# EAGLE design node (EAGLE 9.6.2)
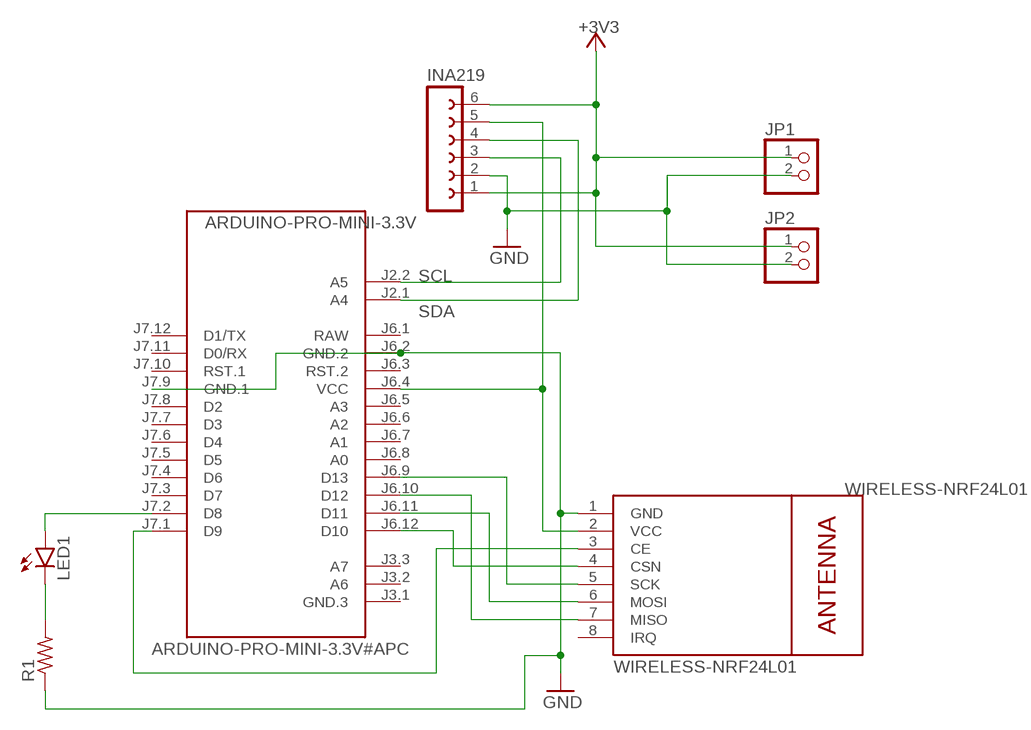
[diagram p0: schematic, sheet 1]

## Parts
ARDUINO-PRO-MINI-3.3V  ARDUINO-PRO-MINI-3.3V#APC  [ARDUINO-PRO-MINI#APC]
INA219  FE06-1  [FE06]
JP1  PINHD-1X2  [1X02]
JP2  PINHD-1X2  [1X02]
LED1  LED3MM  [LED3MM]
R1  R-US_0204/7  [0204/7]
WIRELESS-NRF24L01  WIRELESS-NRF24L01  [WIRELESS-NRF24L01]

## Nets
+3V3: INA219.1 INA219.6 JP1.1 JP2.1
GND: ARDUINO-PRO-MINI-3.3V.J6.2(GND.2) ARDUINO-PRO-MINI-3.3V.J7.9(GND.1) INA219.2 JP1.2 JP2.2 R1.1 WIRELESS-NRF24L01.1(GND)
N$1: ARDUINO-PRO-MINI-3.3V.J7.2(D8) LED1.A
N$2: LED1.K(C) R1.2
N$14: ARDUINO-PRO-MINI-3.3V.J6.4(VCC) INA219.5 WIRELESS-NRF24L01.2(VCC)
N$15: ARDUINO-PRO-MINI-3.3V.J6.12(D10) WIRELESS-NRF24L01.4(CSN)
N$16: ARDUINO-PRO-MINI-3.3V.J7.1(D9) WIRELESS-NRF24L01.3(CE)
N$17: ARDUINO-PRO-MINI-3.3V.J6.9(D13) WIRELESS-NRF24L01.5(SCK)
N$18: ARDUINO-PRO-MINI-3.3V.J6.11(D11) WIRELESS-NRF24L01.6(MOSI)
N$19: ARDUINO-PRO-MINI-3.3V.J6.10(D12) WIRELESS-NRF24L01.7(MISO)
SCL: ARDUINO-PRO-MINI-3.3V.J2.2(A5) INA219.3
SDA: ARDUINO-PRO-MINI-3.3V.J2.1(A4) INA219.4
Unconnected: ARDUINO-PRO-MINI-3.3V.J3.1(GND.3) ARDUINO-PRO-MINI-3.3V.J3.2(A6) ARDUINO-PRO-MINI-3.3V.J3.3(A7) ARDUINO-PRO-MINI-3.3V.J6.3(RST.2) ARDUINO-PRO-MINI-3.3V.J6.5(A3) ARDUINO-PRO-MINI-3.3V.J6.6(A2) ARDUINO-PRO-MINI-3.3V.J6.7(A1) ARDUINO-PRO-MINI-3.3V.J6.8(A0) ARDUINO-PRO-MINI-3.3V.J7.3(D7) ARDUINO-PRO-MINI-3.3V.J7.4(D6) ARDUINO-PRO-MINI-3.3V.J7.5(D5) ARDUINO-PRO-MINI-3.3V.J7.6(D4) ARDUINO-PRO-MINI-3.3V.J7.7(D3) ARDUINO-PRO-MINI-3.3V.J7.8(D2) ARDUINO-PRO-MINI-3.3V.J7.10(RST.1) ARDUINO-PRO-MINI-3.3V.J7.11(D0/RX) ARDUINO-PRO-MINI-3.3V.J7.12(D1/TX) WIRELESS-NRF24L01.8(IRQ)

## Power pins joined to a net without a drawn wire
RAW: ARDUINO-PRO-MINI-3.3V.J6.1(RAW)

## Library data of the parts
ARDUINO-PRO-MINI-3.3V = diy-modules:ARDUINO-PRO-MINI-*#APC: Arduino Pro Mini (and compatible devices) with angle programming connector More details available here: https://www.arduino.cc/en/Main/ArduinoBoardProMini Click here to find device on ebay.com <http://www.ebay.com/sch/arduino+pro+mini>
INA219 = con-lsta:FE06-1: FEMALE HEADER; OC_FARNELL: unknown; OC_NEWARK: unknown
JP1 JP2 = pinhead:PINHD-1X2: PIN HEADER
LED1 = led:LED: LED OSRAM: - CHIPLED LG R971, LG N971, LY N971, LG Q971, LY Q971, LO R971, LY R971 LH N974, LH R974 LS Q976, LO Q976, LY Q976 LO Q996 - Hyper CHIPLED LW Q18S LB Q993, LB Q99A, LB R99A - SideLED LS A670, LO A670, LY A670, LG A670, LP A670 LB A673, LV A673, LT A673, LW A673 LH A674 LY A675 LS A676, LA A676, LO A676, LY A676, LW A676 LS A679, LY A679, LG A679 - Hyper Micro SIDELED® LS Y876, LA Y876, LO Y876, LY Y876 LT Y87S - SmartLED LW L88C, LW L88S LB L89C, LB L89S, LG L890 LS L89K, LO L89K, LY L89K LS L896, LA L896, LO L896, LY L896 - TOPLED LS T670, LO T670, LY T670, LG T670, LP T670 LSG T670, LSP T670, LSY T670, LOP T670, LYG T670 LG T671, LOG T671, LSG T671 LB T673, LV T673, LT T673, LW T673 LH T674 LS T676, LA T676, LO T676, LY T676, LB T676, LH T676, LSB T676, LW T676 LB T67C, LV T67C, LT T67C, LS T67K, LO T67K, LY T67K, LW E67C LS E67B, LA E67B, LO E67B, LY E67B, LB E67C, LV E67C, LT E67C LW T67C LS T679, LY T679, LG T679 LS T770, LO T770, LY T770, LG T770, LP T770 LB T773, LV T773, LT T773, LW T773 LH T774 LS E675, LA E675, LY E675, LS T675 LS T776, LA T776, LO T776, LY T776, LB T776 LHGB T686 LT T68C, LB T68C - Hyper Mini TOPLED® LB M676 - Mini TOPLED Santana® LG M470 LS M47K, LO M47K, LY M47K Source: http://www.osram.convergy.de LUXEON: - LUMILED® LXK2-PW12-R00, LXK2-PW12-S00, LXK2-PW14-U00, LXK2-PW14-V00 LXK2-PM12-R00, LXK2-PM12-S00, LXK2-PM14-U00 LXK2-PE12-Q00, LXK2-PE12-R00, LXK2-PE12-S00, LXK2-PE14-T00, LXK2-PE14-U00 LXK2-PB12-K00, LXK2-PB12-L00, LXK2-PB12-M00, LXK2-PB14-N00, LXK2-PB14-P00, LXK2-PB14-Q00 LXK2-PR12-L00, LXK2-PR12-M00, LXK2-PR14-Q00, LXK2-PR14-R00 LXK2-PD12-Q00, LXK2-PD12-R00, LXK2-PD12-S00 LXK2-PH12-R00, LXK2-PH12-S00 LXK2-PL12-P00, LXK2-PL12-Q00, LXK2-PL12-R00 Source: www.luxeon.com KINGBRIGHT: KA-3528ASYC Source: www.kingbright.com
R1 = rcl:R-US_: RESISTOR, American symbol; SPICEPREFIX: R
WIRELESS-NRF24L01 = diy-modules:WIRELESS-NRF24L01: 2.4 GHz Wireless Module based on NRF24L01 chip More details available here: http://www.electrodragon.com/w/NRF24L01 Click here to find device on ebay.com <http://www.ebay.com/sch/nrf24l01+arduino>

## Board
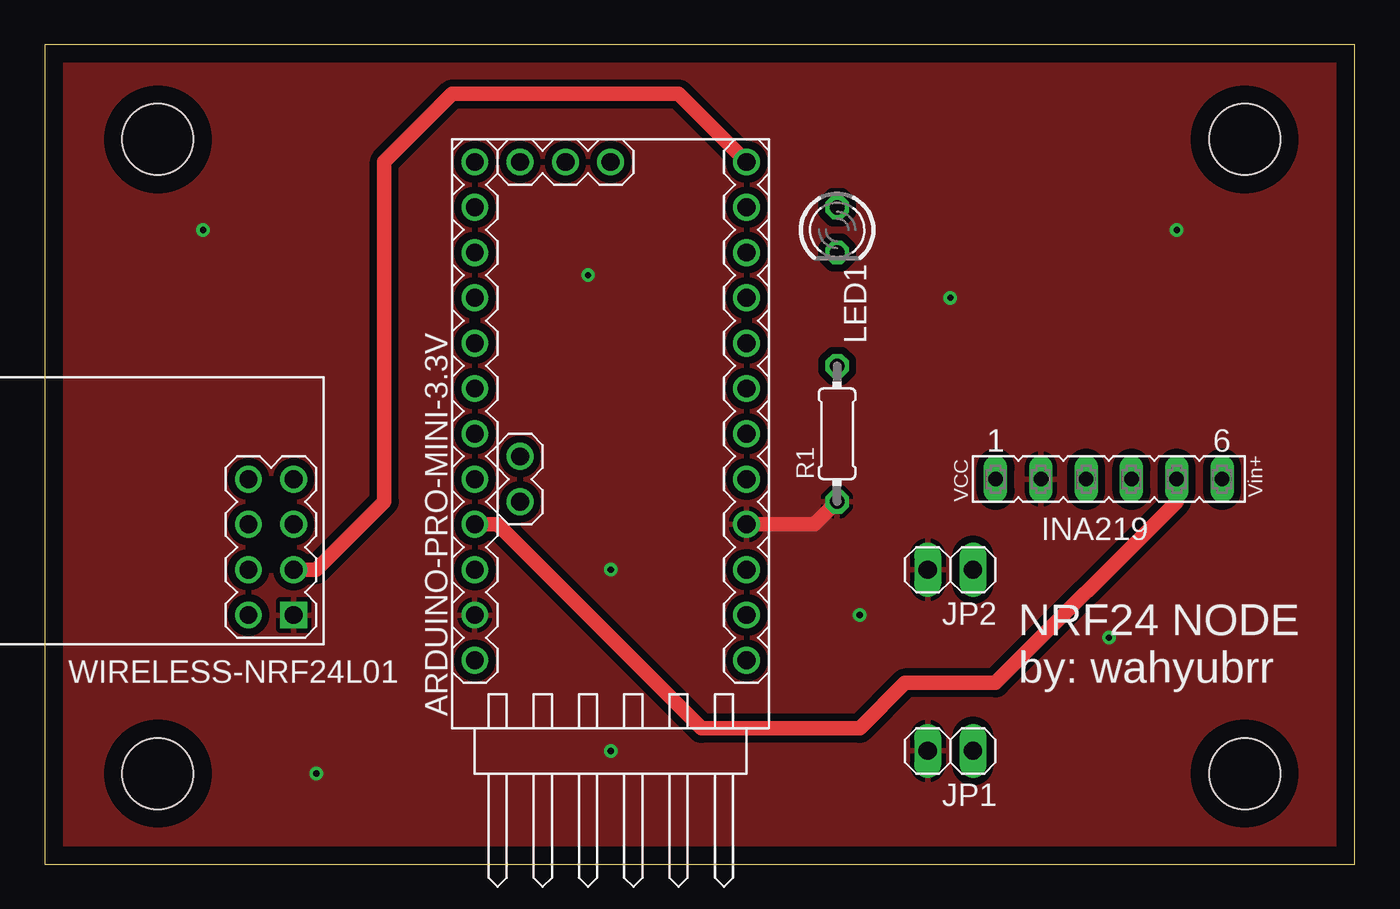
[diagram p1: board, top side]
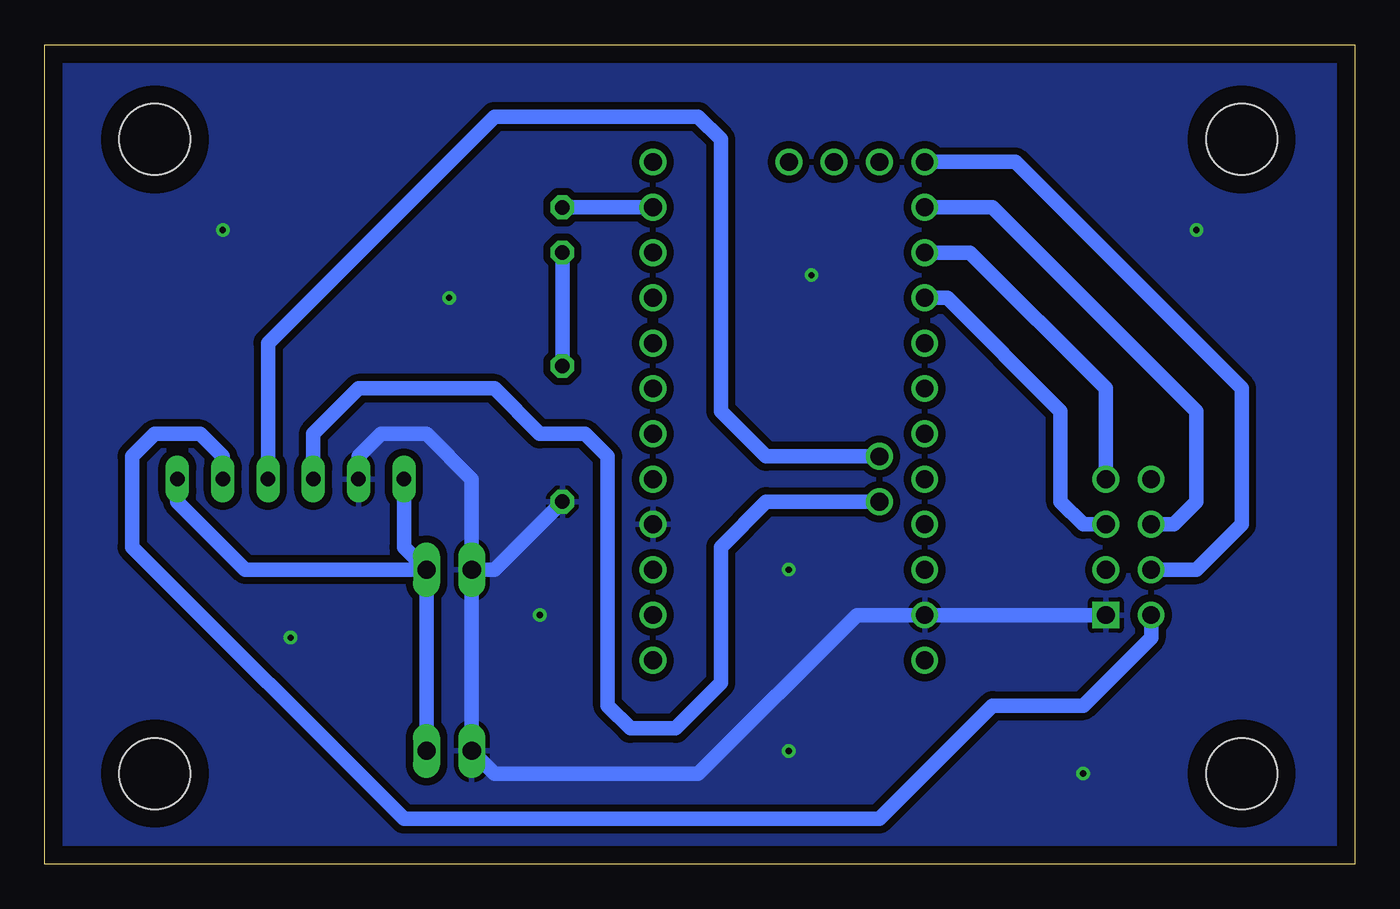
[diagram p2: board, bottom side, seen from below]

Size 73.49 x 45.95 mm. Coordinates in mm from the lower left corner, seen from the top.
Outline: 0,0 73.49,0 73.49,45.95 0,45.95 0,0
Copper layers (1*16): Top 0.035mm / dielectric 1.5mm / Bottom 0.035mm
Design rules "default": minimum track width 6mil, minimum drill 0.35mm, track to track 6mil, track to pad 6mil, pad to pad 6mil, via to via 6mil, smd to smd 6mil, copper to edge 40mil, drill to drill 6mil, minimum pad ring 10mil, minimum via ring 8mil, stop-mask expansion 4mil, vias tented up to drill 0mil, thermal gap 10mil
Holes 4 mm at 67.31,5.08 67.31,40.64 6.35,5.08 6.35,40.64

### Footprints (pad centres in the part's own frame; a part is rotated, then mirrored left to right if it is on the bottom)
ARDUINO-PRO-MINI#APC = drill 1: J2.1 -1.27,5.08; J2.2 -3.81,5.08; J3.1 15.24,0; J3.2 15.24,2.54; J3.3 15.24,5.08; J6.1 -12.7,7.62; J6.2 -10.16,7.62; J6.3 -7.62,7.62; J6.4 -5.08,7.62; J6.5 -2.54,7.62; J6.6 0,7.62; J6.7 2.54,7.62; J6.8 5.08,7.62; J6.9 7.62,7.62; J6.10 10.16,7.62; J6.11 12.7,7.62; J6.12 15.24,7.62; J7.1 15.24,-7.62; J7.2 12.7,-7.62; J7.3 10.16,-7.62; J7.4 7.62,-7.62; J7.5 5.08,-7.62; J7.6 2.54,-7.62; J7.7 0,-7.62; J7.8 -2.54,-7.62; J7.9 -5.08,-7.62; J7.10 -7.62,-7.62; J7.11 -10.16,-7.62; J7.12 -12.7,-7.62
FE06 = drill 0.813 long: 1 -6.35,0; 2 -3.81,0; 3 -1.27,0; 4 1.27,0; 5 3.81,0; 6 6.35,0
1X02 = drill 1.016 long: 1 -1.27,0; 2 1.27,0
LED3MM = drill 0.813 octagon: A -1.27,0; K 1.27,0
0204/7 = drill 0.813 octagon: 1 -3.81,0; 2 3.81,0
WIRELESS-NRF24L01 = drill 1 square: 1 -12.7,6.35 | drill 1: 2 -10.16,6.35; 3 -12.7,3.81; 4 -10.16,3.81; 5 -12.7,1.27; 6 -10.16,1.27; 7 -12.7,-1.27; 8 -10.16,-1.27

### Placement (x,y rotation side)
ARDUINO-PRO-MINI-3.3V  31.75,24.13 90 top
INA219  59.69,21.59 0 top
JP1  50.8,6.35 180 top
JP2  50.8,16.51 180 top
LED1  44.45,35.56 270 top
R1  44.45,24.13 90 top
WIRELESS-NRF24L01  1.27,20.32 180 top

### Tracks (layer width: path | path; a pad name or v marks a point on that pad's centre or on a via)
+3V3
  Bottom 0.813: INA219.1 53.34,17.78 JP2.1 | JP2.1 62.23,16.51 66.04,20.32 INA219.6 | JP2.1 JP1.1
GND  (via drill 0.35)
  Top 0.813: ARDUINO-PRO-MINI-3.3V.J7.9 43.18,19.05 R1.1
  Bottom 0.813: JP2.2 JP1.2 48.26,5.08 36.83,5.08 27.94,13.97 ARDUINO-PRO-MINI-3.3V.J6.2 WIRELESS-NRF24L01.1 | JP2.2 48.26,16.51 R1.1 | JP2.2 49.53,21.59 52.07,24.13 54.61,24.13 55.88,22.86 INA219.2
  other vias: 8.89,35.56 30.48,33.02 63.5,35.56 50.8,31.75 45.72,13.97 31.75,16.51 59.69,12.7 15.24,5.08 31.75,6.35
  pour Bottom (isolate 0.406): 0,45.72 73.66,45.72 73.66,0 0,0
  pour Top (isolate 0.406): 0,45.72 73.66,45.72 73.66,0 0,0
N$1
  Bottom 0.813: ARDUINO-PRO-MINI-3.3V.J7.2 LED1.A
N$2
  Bottom 0.813: LED1.K R1.2
N$14
  Top 0.813: INA219.5 63.5,20.32 53.34,10.16 48.26,10.16 45.72,7.62 36.83,7.62 25.4,19.05 ARDUINO-PRO-MINI-3.3V.J6.4
  Bottom 0.813: WIRELESS-NRF24L01.2 11.43,12.7 15.24,8.89 20.32,8.89 26.67,2.54 53.34,2.54 68.58,17.78 68.58,22.86 67.31,24.13 64.77,24.13 63.5,22.86 INA219.5
N$15
  Bottom 0.813: WIRELESS-NRF24L01.4 8.89,16.51 6.35,19.05 6.35,26.67 19.05,39.37 ARDUINO-PRO-MINI-3.3V.J6.12
N$16
  Top 0.813: ARDUINO-PRO-MINI-3.3V.J7.1 35.56,43.18 22.86,43.18 19.05,39.37 19.05,20.32 15.24,16.51 WIRELESS-NRF24L01.3
N$17
  Bottom 0.813: WIRELESS-NRF24L01.5 15.24,19.05 16.51,20.32 16.51,25.4 22.86,31.75 ARDUINO-PRO-MINI-3.3V.J6.9
N$18
  Bottom 0.813: WIRELESS-NRF24L01.6 10.16,19.05 8.89,20.32 8.89,25.4 20.32,36.83 ARDUINO-PRO-MINI-3.3V.J6.11
N$19
  Bottom 0.813: ARDUINO-PRO-MINI-3.3V.J6.10 21.59,34.29 13.97,26.67 WIRELESS-NRF24L01.7
SCL
  Bottom 0.813: ARDUINO-PRO-MINI-3.3V.J2.2 33.02,20.32 35.56,17.78 35.56,10.16 38.1,7.62 40.64,7.62 41.91,8.89 41.91,22.86 43.18,24.13 45.72,24.13 48.26,26.67 55.88,26.67 58.42,24.13 INA219.3
SDA
  Bottom 0.813: ARDUINO-PRO-MINI-3.3V.J2.1 33.02,22.86 35.56,25.4 35.56,40.64 36.83,41.91 48.26,41.91 60.96,29.21 INA219.4

### Text on the board
tNames: Vin+ | VCC | NRF24 NODE / by: wahyubrr